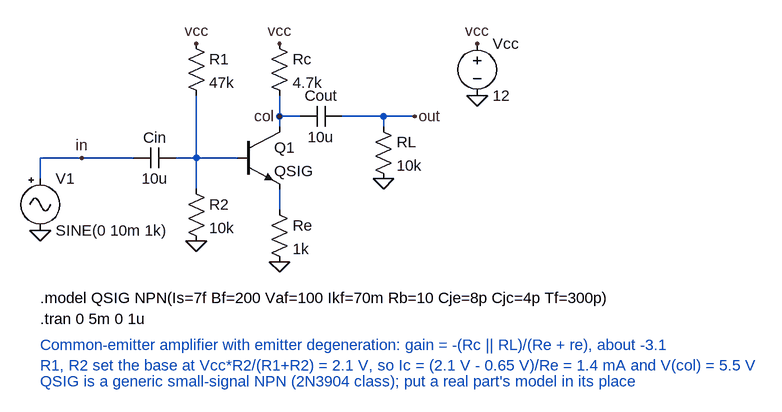
[diagram p0: schematic ce_amplifier.asc]
ce_amplifier.asc, the LTspice schematic file:
Version 4
SHEET 1 880 680
WIRE 0 256 0 288
WIRE 144 256 0 256
WIRE 240 256 208 256
WIRE 304 256 240 256
WIRE 240 160 240 304
WIRE 368 160 368 208
WIRE 400 192 368 192
WIRE 528 192 464 192
WIRE 576 192 528 192
WIRE 528 208 528 192
WIRE 368 304 368 336
FLAG 0 368 0
FLAG 64 256 in
FLAG 240 80 vcc
FLAG 368 80 vcc
FLAG 368 192 col
FLAG 240 384 0
FLAG 368 416 0
FLAG 528 288 0
FLAG 576 192 out
FLAG 672 80 vcc
FLAG 672 160 0
SYMBOL Misc\signal 0 272 R0
SYMATTR InstName V1
SYMATTR Value SINE(0 10m 1k)
SYMBOL cap 208 240 R90
WINDOW 0 0 32 VBottom 2
WINDOW 3 32 32 VTop 2
SYMATTR InstName Cin
SYMATTR Value 10u
SYMBOL res 224 64 R0
SYMATTR InstName R1
SYMATTR Value 47k
SYMBOL res 224 288 R0
SYMATTR InstName R2
SYMATTR Value 10k
SYMBOL npn 304 208 R0
SYMATTR InstName Q1
SYMATTR Value QSIG
SYMBOL res 352 64 R0
SYMATTR InstName Rc
SYMATTR Value 4.7k
SYMBOL res 352 320 R0
SYMATTR InstName Re
SYMATTR Value 1k
SYMBOL cap 464 176 R90
WINDOW 0 0 32 VBottom 2
WINDOW 3 32 32 VTop 2
SYMATTR InstName Cout
SYMATTR Value 10u
SYMBOL res 512 192 R0
SYMATTR InstName RL
SYMATTR Value 10k
SYMBOL voltage 672 64 R0
SYMATTR InstName Vcc
SYMATTR Value 12
TEXT 0 472 Left 2 !.model QSIG NPN(Is=7f Bf=200 Vaf=100 Ikf=70m Rb=10 Cje=8p Cjc=4p Tf=300p)
TEXT 0 504 Left 2 !.tran 0 5m 0 1u
TEXT 0 544 Left 2 ;Common-emitter amplifier with emitter degeneration: gain = -(Rc || RL)/(Re + re), about -3.1\nR1, R2 set the base at Vcc*R2/(R1+R2) = 2.1 V, so Ic = (2.1 V - 0.65 V)/Re = 1.4 mA and V(col) = 5.5 V
TEXT 0 600 Left 2 ;QSIG is a generic small-signal NPN (2N3904 class); put a real part's model in its place

The netlist it stands for:
* ce_amplifier.asc
V1 in 0 SINE(0 10m 1k)
Cin N001 in 10u
R1 vcc N001 47k
R2 N001 0 10k
Q1 col N001 N002 0 QSIG
Rc vcc col 4.7k
Re N002 0 1k
Cout out col 10u
RL out 0 10k
Vcc vcc 0 12
.model NPN NPN
.model PNP PNP
.lib standard.bjt
.model QSIG NPN(Is=7f Bf=200 Vaf=100 Ikf=70m Rb=10 Cje=8p Cjc=4p Tf=300p)
.tran 0 5m 0 1u
* Common-emitter amplifier with emitter degeneration: gain = -(Rc || RL)/(Re + re), about -3.1
* R1, R2 set the base at Vcc*R2/(R1+R2) = 2.1 V, so Ic = (2.1 V - 0.65 V)/Re = 1.4 mA and V(col) = 5.5 V
* QSIG is a generic small-signal NPN (2N3904 class); put a real part's model in its place
.backanno
.end